# Altium schematic sheet SCH.SchDoc
size A; SheetNumber: 1; SheetTotal: 1
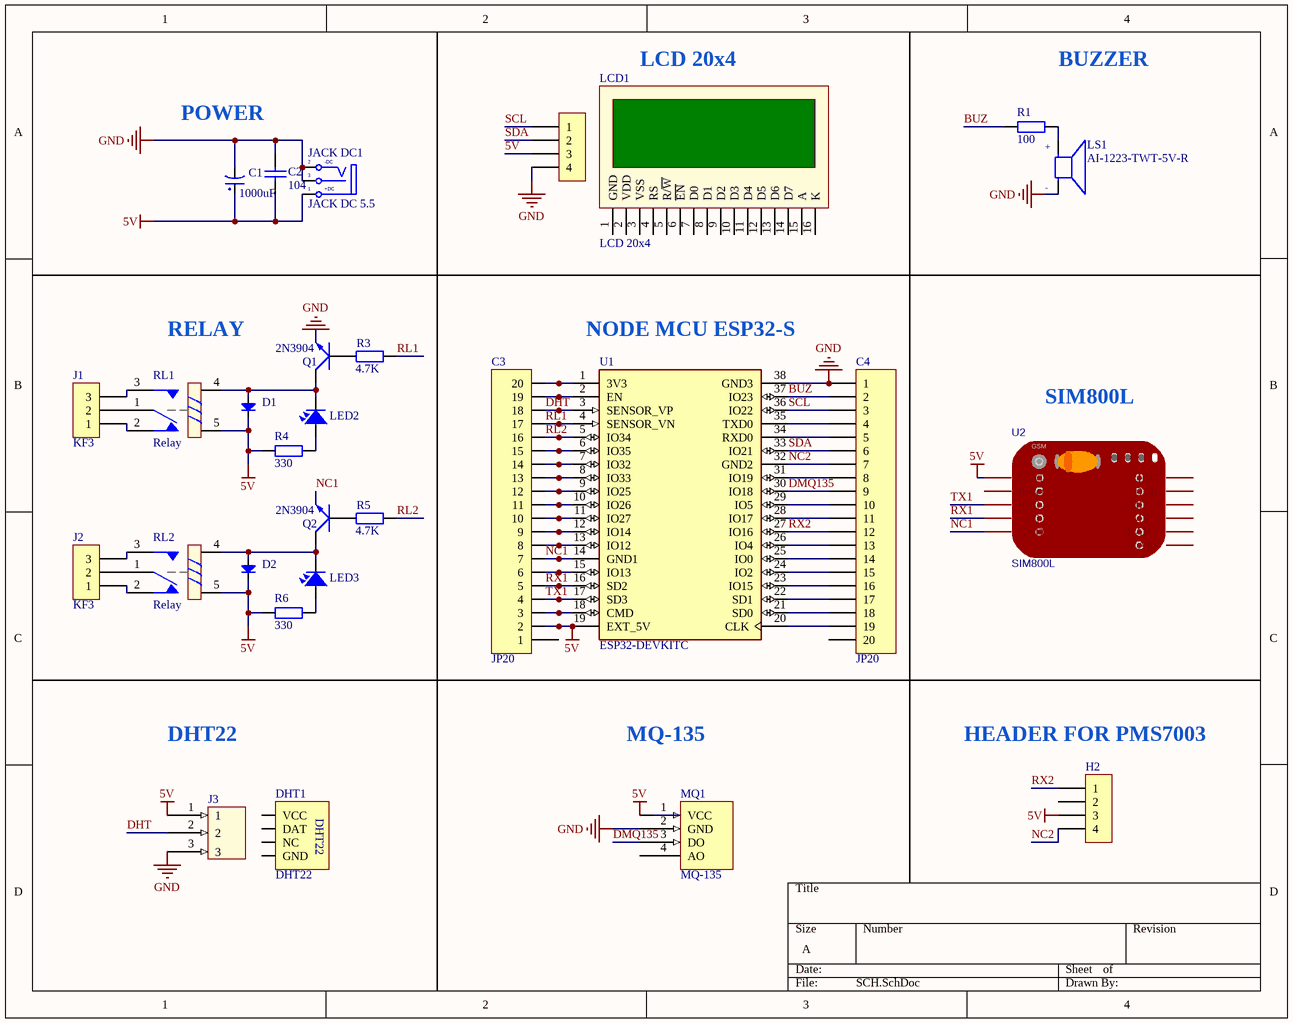
[diagram p0: SCH.SchDoc]

## Parts
C1  1000uF  [tu hoa 10mm]
C2  104  [tu gom]
C3  JP20  [JP20-C1T]
C4  JP20  [JP20-C1T]
D1  Diode  [DIO-1A]  (value not drawn)
D2  Diode  [DIO-1A]  (value not drawn)
DHT1  DHT22  [DHT22]
H1  Header 4P 2.54  [XH2.54M-4]  (value not drawn)
H2  Header 4P 2.54 Duc Thang  [XH2.54M-4]  (value not drawn)
J1  KF3  [KF3-5.08]
J2  KF3  [KF3-5.08]
J3  (no value)  [CON3_100_B3B-XH-A_TH_ST]
JACK_DC1  JACK DC 5.5  [JACK DC 5.5]
LCD1  LCD 20x4  [LCD20X4A]
LED2  LED  [LED-5MM-RED]  (value not drawn)
LED3  LED  [LED-5MM-RED]  (value not drawn)
LS1  AI-1223-TWT-5V-R  [XDCR_AI-1223-TWT-5V-R]
MQ1  MQ-135  [MQ-135]
Q1  2N3904  [TO92-123]
Q2  2N3904  [TO92-123]
R1  100  [tro vach 1/4w]
R3  4.7K  [tro vach 1/4w]
R4  330  [tro vach 1/4w]
R5  4.7K  [tro vach 1/4w]
R6  330  [tro vach 1/4w]
RL1  Relay  [Relay 5 Chan SRD]
RL2  Relay  [Relay 5 Chan SRD]
U1  ESP32-DEVKITC  [MODULE_ESP32-DEVKITC]
U2  SIM800L  [SIM800L MODULE]

## Nets
5V: C1.1 C2.2 C3.2 D1.2(K) D2.2(K) H1.3 H2.3 J3.1 JACK_DC1.1(T) MQ1.1(VCC) R4.2 R6.2 RL1.5 RL2.5 U1.19(EXT_5V) U2.1(VCC)
GND: C1.2 C2.1 C4.1 H1.4 J3.3 JACK_DC1.2(TN) JACK_DC1.3(S) LS1.N(NEG) MQ1.2(GND) Q1.1(E) U1.38(GND3)
BUZ: C4.2 R1.2 U1.37(IO23)
DHT: C3.18 J3.2 U1.3(SENSOR_VP)
DMQ135: C4.9 MQ1.3(DO) U1.30(IO18)
NC1: C3.7 Q2.1(E) U1.14(GND1) U2.5(GND)
NC2: C4.7 H2.4 U1.32(GND2)
RL1: C3.17 R3.1 U1.4(SENSOR_VN)
RL2: C3.16 R5.1 U1.5(IO34)
RX1: C3.5 U1.16(SD2) U2.4(TxD)
RX2: C4.12 H2.1 U1.27(IO16)
SCL: C4.3 H1.1 U1.36(IO22)
SDA: C4.6 H1.2 U1.33(IO21)
TX1: C3.4 U1.17(SD3) U2.3(RxD)
NetC3_3: C3.3 U1.18(CMD)
NetC3_6: C3.6 U1.15(IO13)
NetC3_8: C3.8 U1.13(IO12)
NetC3_9: C3.9 U1.12(IO14)
NetC3_10: C3.10 U1.11(IO27)
NetC3_11: C3.11 U1.10(IO26)
NetC3_12: C3.12 U1.9(IO25)
NetC3_13: C3.13 U1.8(IO33)
NetC3_14: C3.14 U1.7(IO32)
NetC3_15: C3.15 U1.6(IO35)
NetC3_19: C3.19 U1.2(EN)
NetC3_20: C3.20 U1.1(3V3)
NetC4_4: C4.4 U1.35(TXD0)
NetC4_5: C4.5 U1.34(RXD0)
NetC4_8: C4.8 U1.31(IO19)
NetC4_10: C4.10 U1.29(IO5)
NetC4_11: C4.11 U1.28(IO17)
NetC4_13: C4.13 U1.26(IO4)
NetC4_14: C4.14 U1.25(IO0)
NetC4_15: C4.15 U1.24(IO2)
NetC4_16: C4.16 U1.23(IO15)
NetC4_17: C4.17 U1.22(SD1)
NetC4_18: C4.18 U1.21(SD0)
NetC4_19: C4.19 U1.20(CLK)
NetD1_1: D1.1(A) LED2.2 Q1.3(C) RL1.4
NetD2_1: D2.1(A) LED3.2 Q2.3(C) RL2.4
NetJ1_1: J1.1 RL1.2
NetJ1_2: J1.2 RL1.1
NetJ1_3: J1.3 RL1.3
NetJ2_1: J2.1 RL2.2
NetJ2_2: J2.2 RL2.1
NetJ2_3: J2.3 RL2.3
NetLED2_1: LED2.1 R4.1
NetLED3_1: LED3.1 R6.1
NetLS1_P: LS1.P(POS) R1.1
NetQ1_2: Q1.2(B) R3.2
NetQ2_2: Q2.2(B) R5.2

Not connected (* = marked no-connect by the designer): C3 1; C4 20; DHT1 1(VCC) 2(DAT) 3(NC) 4(GND); H2 2; LCD1 1(GND) 2(VDD) 3(VSS) 4(RS) 5(R/~{W}) 6(~{EN}) 7(D0) 8(D1) 9(D2) 10(D3) 11(D4) 12(D5) 13(D6) 14(D7) 15(A) 16(K); MQ1 4(AO); U2 2(Reset) 6(RIRG) 7(DTR) 8(MIC+) 9(MIC-) 10(EAR+) 11(EAR-)

## Notes on the sheet
- LCD 20x4
- BUZZER
- POWER
- RELAY
- (near U1) NODE MCU ESP32-S
- SIM800L
- DHT22
- MQ-135
- (near H2) HEADER FOR PMS7003
- (in symbol AI-1223-TWT-5V-R) +; -
- (in symbol JACK DC 5.5) -DC; +DC
- (in symbol SIM800L) GSM

## Library data of the parts
C1 = Tu Hoa 1000uF 10V 10x12: Cắm; So_Chan: 2; Don_Vi: Con; Ten_Linh_Kien: Tụ Hóa 1000uF 10V 10x12MM; Ma_Hang: MH006614; Kieu_Chan: *; Chung_Loai: Cắm
C2 = Tu gom 104 50V: Cắm; So_Chan: 2; Ten_Linh_Kien: Tụ gốm 104 100nF 50V; Don_Vi: Con; Ma_Hang: MH004761; Chung_Loai: Cắm; Kieu_Chan: *
C3 C4 = JP20: WR-PHD 2.54 mm Angled Socket Header; Manufacturer: W¨¹rth Elektronik eiSos GmbH; partNo: 613020143121; ComponentLink1 Description: Manufacturer; ComponentLink2 Description: Datasheet; NoPins: 20; Created Date: 29 March 2013; ComponentLink1URL: http://www.we-online.com; ComponentLink2URL: http://katalog.we-online.de/em/datasheet/6130xx143121.pdf; Created by: Karrer Zheng
D1 D2 = Diode: Default Diode; Code - JEDEC: DO-214-AB; Value: 1N5007; Published: 8-Jun-2000; Revision: July-2002: Re-released for DXP Platform.; Publisher: Altium Limited
DHT1 = DHT22: Manufacturer: W¨¹rth Elektronik eiSos GmbH; partNo: 613004143121; ComponentLink1 Description: Manufacturer; ComponentLink2 Description: Datasheet; NoPins: 04; Created Date: 29 March 2013; ComponentLink1URL: http://www.we-online.com; ComponentLink2URL: http://katalog.we-online.de/em/datasheet/6130xx143121.pdf; Created by: Karrer Zheng
H1 H2 = Header 4P 2.54 Duc Thang: Cắm; Ten_Linh_Kien: Header 4P XH2.54-4P Đực Thẳng; Don_Vi: Con; Ma_Hang: MH001285; Chung_Loai: Cắm
J1 J2 = KF3: Manufacturer: Würth Elektronik eiSos GmbH; partNo: 691103110003; ComponentLink1 Description: Manufacturer; ComponentLink2 Description: Datasheet; NoPins: 3; Created Date: 29 October 2013; ComponentLink1URL: http://www.we-online.com; ComponentLink2URL: http://katalog.we-online.de/em/datasheet/6911031100xx.pdf; Created by: Karrer Zheng
J3 = CON-PLG_3X1-100-ST-TH: 3 Pins, 1 Row 2.54mm Pitch, straight Connector, male; Manufacturer: CUI; Manufacturer Part Number: B3B-XH-A(LF)(SN); Mating Part Number: XHP-3; Crimp Part Number: ASXHSXH22K51; Alternate Part Number-1: NA; Case/Package: TH-CON; Supplier-1: ARROW; Supplier Part Number-1: B3B-XH-A(LF)(SN)
JACK_DC1 = JACK DC 5.5: Value: Jac DC
LCD1 = LCD20x4A: LCD dipslay 20 char, 4 line; Value: Jum 40; Value: LCD 20x4A
LED2 LED3 = LED: LED Single colour Green and Red; Value: LED 3 ly Single Colour
LS1 = AI-1223-TWT-5V-R: MF: {'manufacturer': u'PUI Audio,'}; Package: None; Price: None; Value: *; MP: AI-1223-TWT-5V-R; Availability: Unavailable
MQ1 = MQ-135: size: 32x20mm; WEB: TECHMT.VN
Q1 Q2 = 2N904: NPN 600mW, ECB; Value: C1815
R1 R3-R6 = Tro Vach 1/4W 1% 10k: Cắm; Don_Vi: Con; So_Chan: 2; Ten_Linh_Kien: Trở Vạch 1/4w 1% 10k; Ma_Hang: MH006349; Chung_Loai: Cắm; Kieu_Chan: *
RL1 RL2 = Relay 5 Chan SRD: Relay 5 Chan; Ma_Hang: MH009374; Ten: Relay 5V10A SRD-05VDC-SL-C Chính Hãng
U1 = ESP32-DEVKITC: MF: {'manufacturer': u'Olimex LTD'}; Package: None; Price: None; Value: *; MP: ESP32-DEVKITC; Availability: Unavailable
U2 = SIM800L: sourceId: ega4lDVPJ; Contributor: trigui; timeStamp: 1475502242; BOM_Supplier Part: B01DLIJM2E; BOM_Supplier: Amazon; spicePre: U